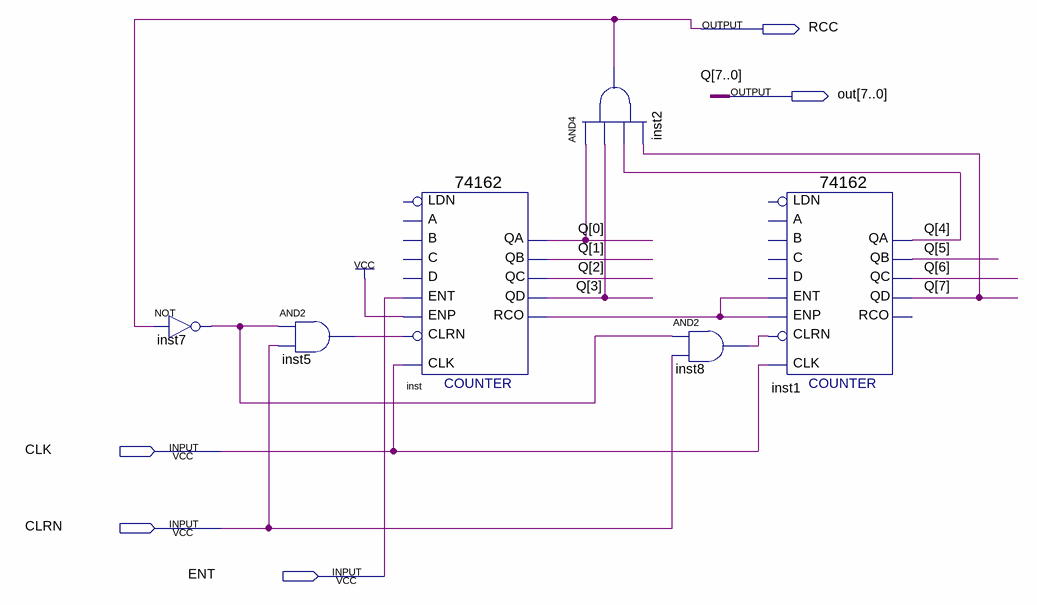
[diagram p0: schematic sheet]
// Quartus schematic 100Counter.bdf as structural Verilog: 6 symbols, 5 pins
module \100Counter  (
  input  CLK,
  input  CLRN,
  input  ENT,
  output RCC,
  output [7:0] out
);

  wire inst5_out, inst7_out, inst8_out, inst_rco;

  not inst7 (inst7_out, RCC);
  and inst5 (inst5_out, inst7_out, CLRN);
  \74162  inst (
    .ENP(1'b1), .ENT(ENT), .CLRN(inst5_out), .CLK(CLK), .QA(out[0]), .QB(out[1]), .QC(out[2]), .QD(out[3]),
    .RCO(inst_rco));  // open: A, LDN, B, C, D
  and inst2 (RCC, out[0], out[3], out[4], out[7]);
  and inst8 (inst8_out, inst7_out, CLRN);
  \74162  inst1 (
    .ENP(inst_rco), .ENT(inst_rco), .CLRN(inst8_out), .CLK(CLK), .QA(out[4]), .QB(out[5]), .QC(out[6]),
    .QD(out[7]));  // open: A, LDN, B, C, D, RCO

  // Other names for the same wires on the sheet: Q[7:0] = out
endmodule
